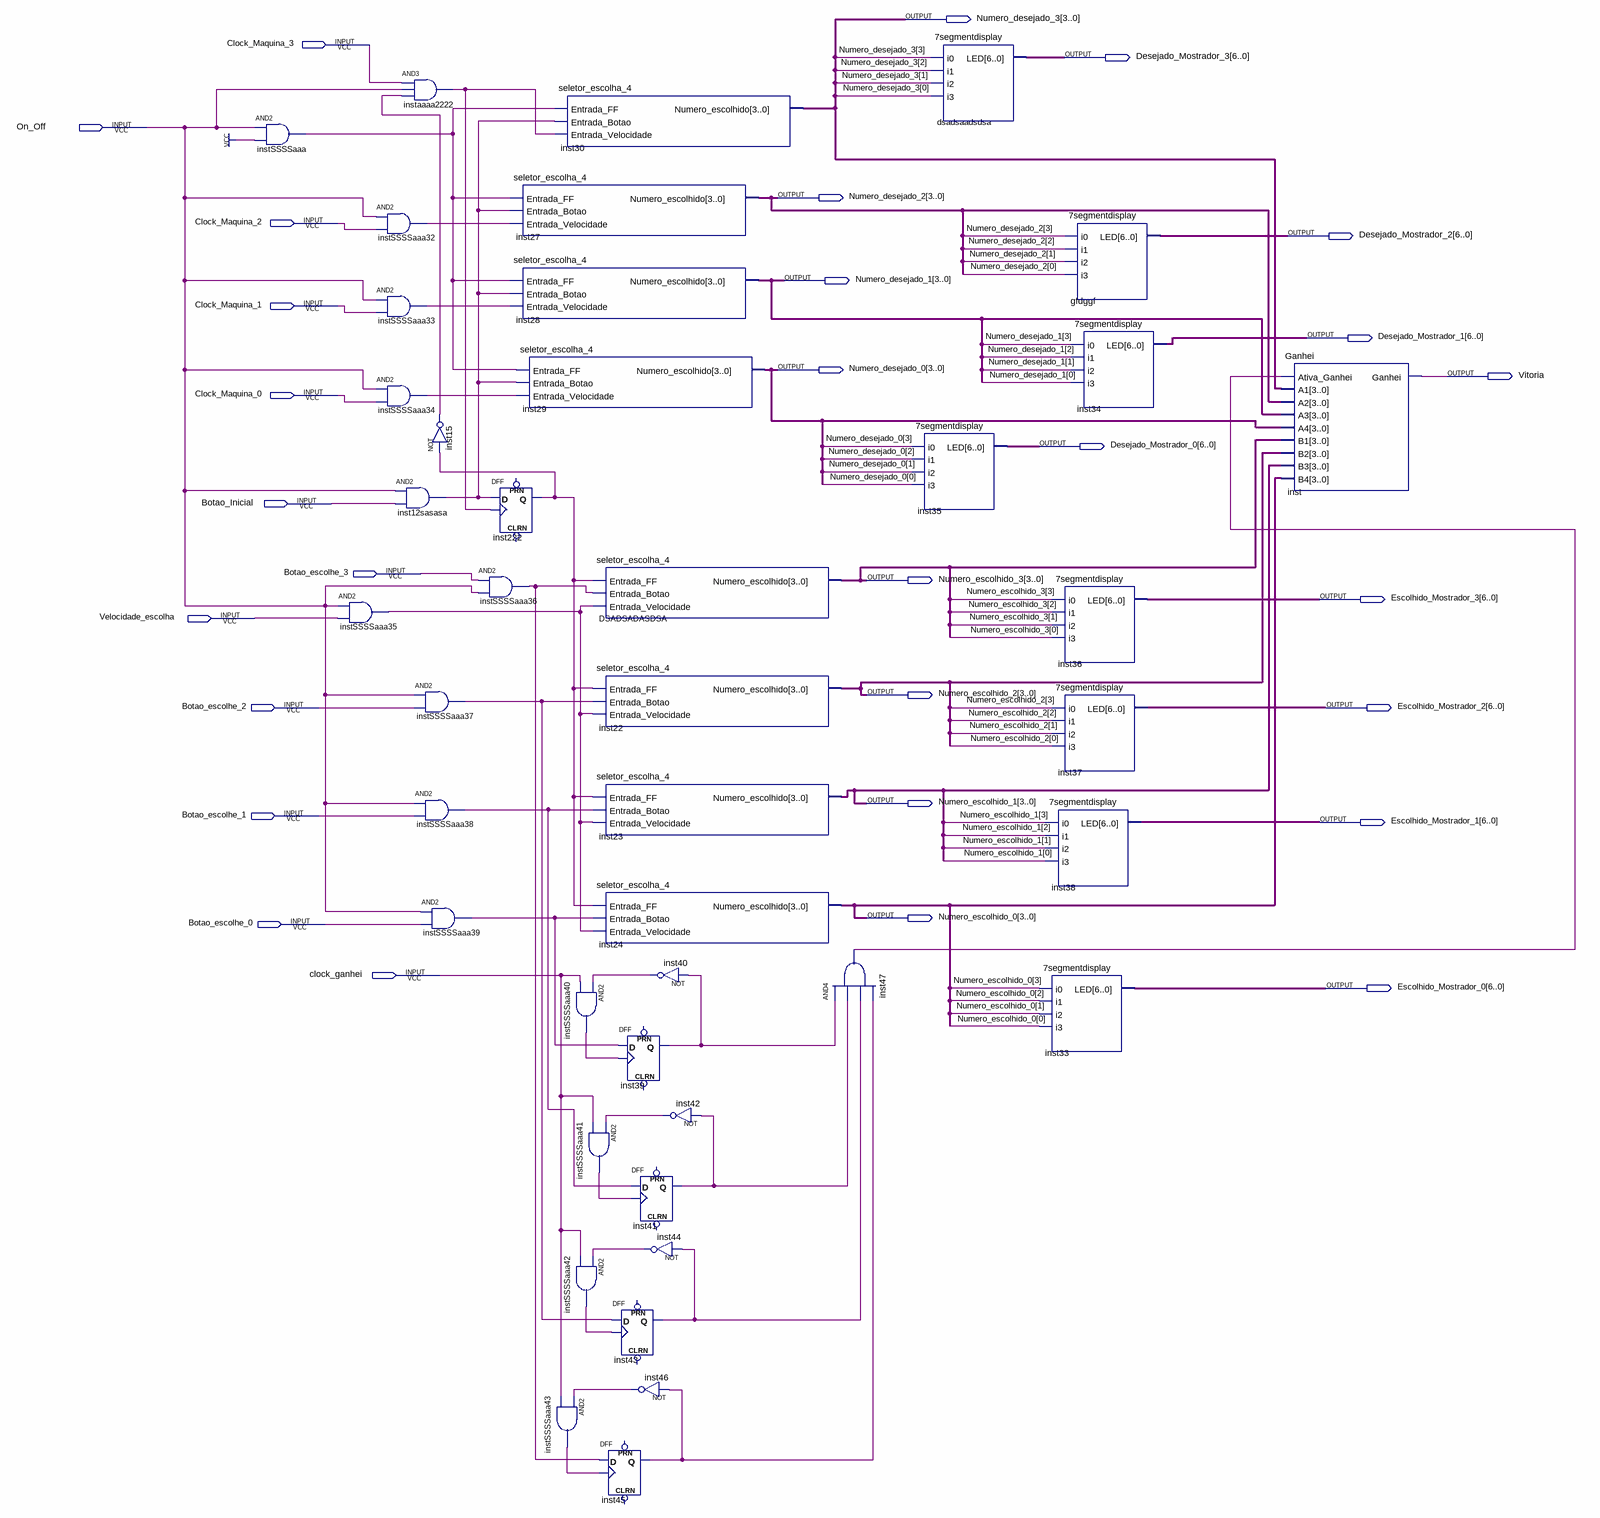
[diagram p0: schematic sheet]
// Quartus schematic ProjetoFinal.bdf as structural Verilog: 43 symbols, 29 pins
module ProjetoFinal (
  input  Clock_Maquina_3,
  input  On_Off,
  input  Clock_Maquina_2,
  input  Clock_Maquina_1,
  input  Clock_Maquina_0,
  input  Botao_Inicial,
  input  Botao_escolhe_3,
  input  Velocidade_escolha,
  input  Botao_escolhe_2,
  input  Botao_escolhe_1,
  input  Botao_escolhe_0,
  input  clock_ganhei,
  output [3:0] Numero_desejado_3,
  output [6:0] Desejado_Mostrador_3,
  output [3:0] Numero_desejado_2,
  output [6:0] Desejado_Mostrador_2,
  output [3:0] Numero_desejado_1,
  output [6:0] Desejado_Mostrador_1,
  output [3:0] Numero_desejado_0,
  output Vitoria,
  output [6:0] Desejado_Mostrador_0,
  output [3:0] Numero_escolhido_3,
  output [6:0] Escolhido_Mostrador_3,
  output [3:0] Numero_escolhido_2,
  output [6:0] Escolhido_Mostrador_2,
  output [3:0] Numero_escolhido_1,
  output [6:0] Escolhido_Mostrador_1,
  output [3:0] Numero_escolhido_0,
  output [6:0] Escolhido_Mostrador_0
);

  wire inst12sasasa_out, inst15_out, inst39_q, inst40_out, inst41_q, inst42_out, inst43_q, inst44_out,
       inst45_q, inst46_out, inst47_out, inst222_q, instaaaa2222_out, instSSSSaaa32_out, instSSSSaaa33_out,
       instSSSSaaa34_out, instSSSSaaa35_out, instSSSSaaa36_out, instSSSSaaa37_out, instSSSSaaa38_out,
       instSSSSaaa39_out, instSSSSaaa40_out, instSSSSaaa41_out, instSSSSaaa42_out, instSSSSaaa43_out,
       instSSSSaaa_out;

  and instSSSSaaa (instSSSSaaa_out, On_Off, 1'b1);
  and instSSSSaaa32 (instSSSSaaa32_out, On_Off, Clock_Maquina_2);
  and instSSSSaaa33 (instSSSSaaa33_out, On_Off, Clock_Maquina_1);
  and instSSSSaaa34 (instSSSSaaa34_out, On_Off, Clock_Maquina_0);
  and instSSSSaaa35 (instSSSSaaa35_out, On_Off, Velocidade_escolha);
  and instaaaa2222 (instaaaa2222_out, Clock_Maquina_3, On_Off, inst15_out);
  not inst15 (inst15_out, inst222_q);
  and inst12sasasa (inst12sasasa_out, On_Off, Botao_Inicial);
  and instSSSSaaa37 (instSSSSaaa37_out, On_Off, Botao_escolhe_2);
  and instSSSSaaa38 (instSSSSaaa38_out, On_Off, Botao_escolhe_1);
  and instSSSSaaa39 (instSSSSaaa39_out, On_Off, Botao_escolhe_0);
  and instSSSSaaa36 (instSSSSaaa36_out, Botao_escolhe_3, On_Off);
  seletor_escolha_4 inst27 (
    .Entrada_FF(instSSSSaaa_out), .Entrada_Botao(inst12sasasa_out), .Entrada_Velocidade(instSSSSaaa32_out),
    .Numero_escolhido(Numero_desejado_2));
  seletor_escolha_4 inst28 (
    .Entrada_FF(instSSSSaaa_out), .Entrada_Botao(inst12sasasa_out), .Entrada_Velocidade(instSSSSaaa33_out),
    .Numero_escolhido(Numero_desejado_1));
  seletor_escolha_4 inst29 (
    .Entrada_FF(instSSSSaaa_out), .Entrada_Botao(inst12sasasa_out), .Entrada_Velocidade(instSSSSaaa34_out),
    .Numero_escolhido(Numero_desejado_0));
  DFF inst222 (.CLK(instaaaa2222_out), .D(inst12sasasa_out), .Q(inst222_q));  // open: CLRN, PRN
  seletor_escolha_4 inst30 (
    .Entrada_FF(instSSSSaaa_out), .Entrada_Botao(inst12sasasa_out), .Entrada_Velocidade(instaaaa2222_out),
    .Numero_escolhido(Numero_desejado_3));
  and instSSSSaaa40 (instSSSSaaa40_out, inst40_out, clock_ganhei);
  and instSSSSaaa41 (instSSSSaaa41_out, inst42_out, clock_ganhei);
  and instSSSSaaa42 (instSSSSaaa42_out, inst44_out, clock_ganhei);
  and instSSSSaaa43 (instSSSSaaa43_out, inst46_out, clock_ganhei);
  seletor_escolha_4 DSADSADASDSA (
    .Entrada_FF(inst222_q), .Entrada_Botao(instSSSSaaa36_out), .Entrada_Velocidade(instSSSSaaa35_out),
    .Numero_escolhido(Numero_escolhido_3));
  seletor_escolha_4 inst22 (
    .Entrada_FF(inst222_q), .Entrada_Botao(instSSSSaaa37_out), .Entrada_Velocidade(instSSSSaaa35_out),
    .Numero_escolhido(Numero_escolhido_2));
  seletor_escolha_4 inst23 (
    .Entrada_FF(inst222_q), .Entrada_Botao(instSSSSaaa38_out), .Entrada_Velocidade(instSSSSaaa35_out),
    .Numero_escolhido(Numero_escolhido_1));
  seletor_escolha_4 inst24 (
    .Entrada_FF(inst222_q), .Entrada_Botao(instSSSSaaa39_out), .Entrada_Velocidade(instSSSSaaa35_out),
    .Numero_escolhido(Numero_escolhido_0));
  DFF inst39 (.CLK(instSSSSaaa40_out), .D(instSSSSaaa39_out), .Q(inst39_q));  // open: CLRN, PRN
  DFF inst41 (.CLK(instSSSSaaa41_out), .D(instSSSSaaa38_out), .Q(inst41_q));  // open: CLRN, PRN
  DFF inst43 (.CLK(instSSSSaaa42_out), .D(instSSSSaaa37_out), .Q(inst43_q));  // open: CLRN, PRN
  not inst46 (inst46_out, inst45_q);
  DFF inst45 (.CLK(instSSSSaaa43_out), .D(instSSSSaaa36_out), .Q(inst45_q));  // open: CLRN, PRN
  not inst40 (inst40_out, inst39_q);
  not inst42 (inst42_out, inst41_q);
  not inst44 (inst44_out, inst43_q);
  and inst47 (inst47_out, inst39_q, inst41_q, inst43_q, inst45_q);
  \7segmentdisplay  dsadsaadsdsa (
    .i0(Numero_desejado_3[3]), .i1(Numero_desejado_3[2]), .i2(Numero_desejado_3[1]),
    .i3(Numero_desejado_3[0]), .LED(Desejado_Mostrador_3));
  \7segmentdisplay  inst35 (
    .i0(Numero_desejado_0[3]), .i1(Numero_desejado_0[2]), .i2(Numero_desejado_0[1]),
    .i3(Numero_desejado_0[0]), .LED(Desejado_Mostrador_0));
  \7segmentdisplay  inst33 (
    .i0(Numero_escolhido_0[3]), .i1(Numero_escolhido_0[2]), .i2(Numero_escolhido_0[1]),
    .i3(Numero_escolhido_0[0]), .LED(Escolhido_Mostrador_0));
  \7segmentdisplay  gfdggf (
    .i0(Numero_desejado_2[3]), .i1(Numero_desejado_2[2]), .i2(Numero_desejado_2[1]),
    .i3(Numero_desejado_2[0]), .LED(Desejado_Mostrador_2));
  \7segmentdisplay  inst34 (
    .i0(Numero_desejado_1[3]), .i1(Numero_desejado_1[2]), .i2(Numero_desejado_1[1]),
    .i3(Numero_desejado_1[0]), .LED(Desejado_Mostrador_1));
  \7segmentdisplay  inst36 (
    .i0(Numero_escolhido_3[3]), .i1(Numero_escolhido_3[2]), .i2(Numero_escolhido_3[1]),
    .i3(Numero_escolhido_3[0]), .LED(Escolhido_Mostrador_3));
  \7segmentdisplay  inst37 (
    .i0(Numero_escolhido_2[3]), .i1(Numero_escolhido_2[2]), .i2(Numero_escolhido_2[1]),
    .i3(Numero_escolhido_2[0]), .LED(Escolhido_Mostrador_2));
  \7segmentdisplay  inst38 (
    .i0(Numero_escolhido_1[3]), .i1(Numero_escolhido_1[2]), .i2(Numero_escolhido_1[1]),
    .i3(Numero_escolhido_1[0]), .LED(Escolhido_Mostrador_1));
  Ganhei inst (
    .Ativa_Ganhei(inst47_out), .A1(Numero_desejado_3), .A2(Numero_desejado_2), .A3(Numero_desejado_1),
    .A4(Numero_desejado_0), .B1(Numero_escolhido_3), .B2(Numero_escolhido_2), .B3(Numero_escolhido_1),
    .B4(Numero_escolhido_0), .Ganhei(Vitoria));
endmodule
